# EAGLE design schematic (EAGLE 9.4.2)
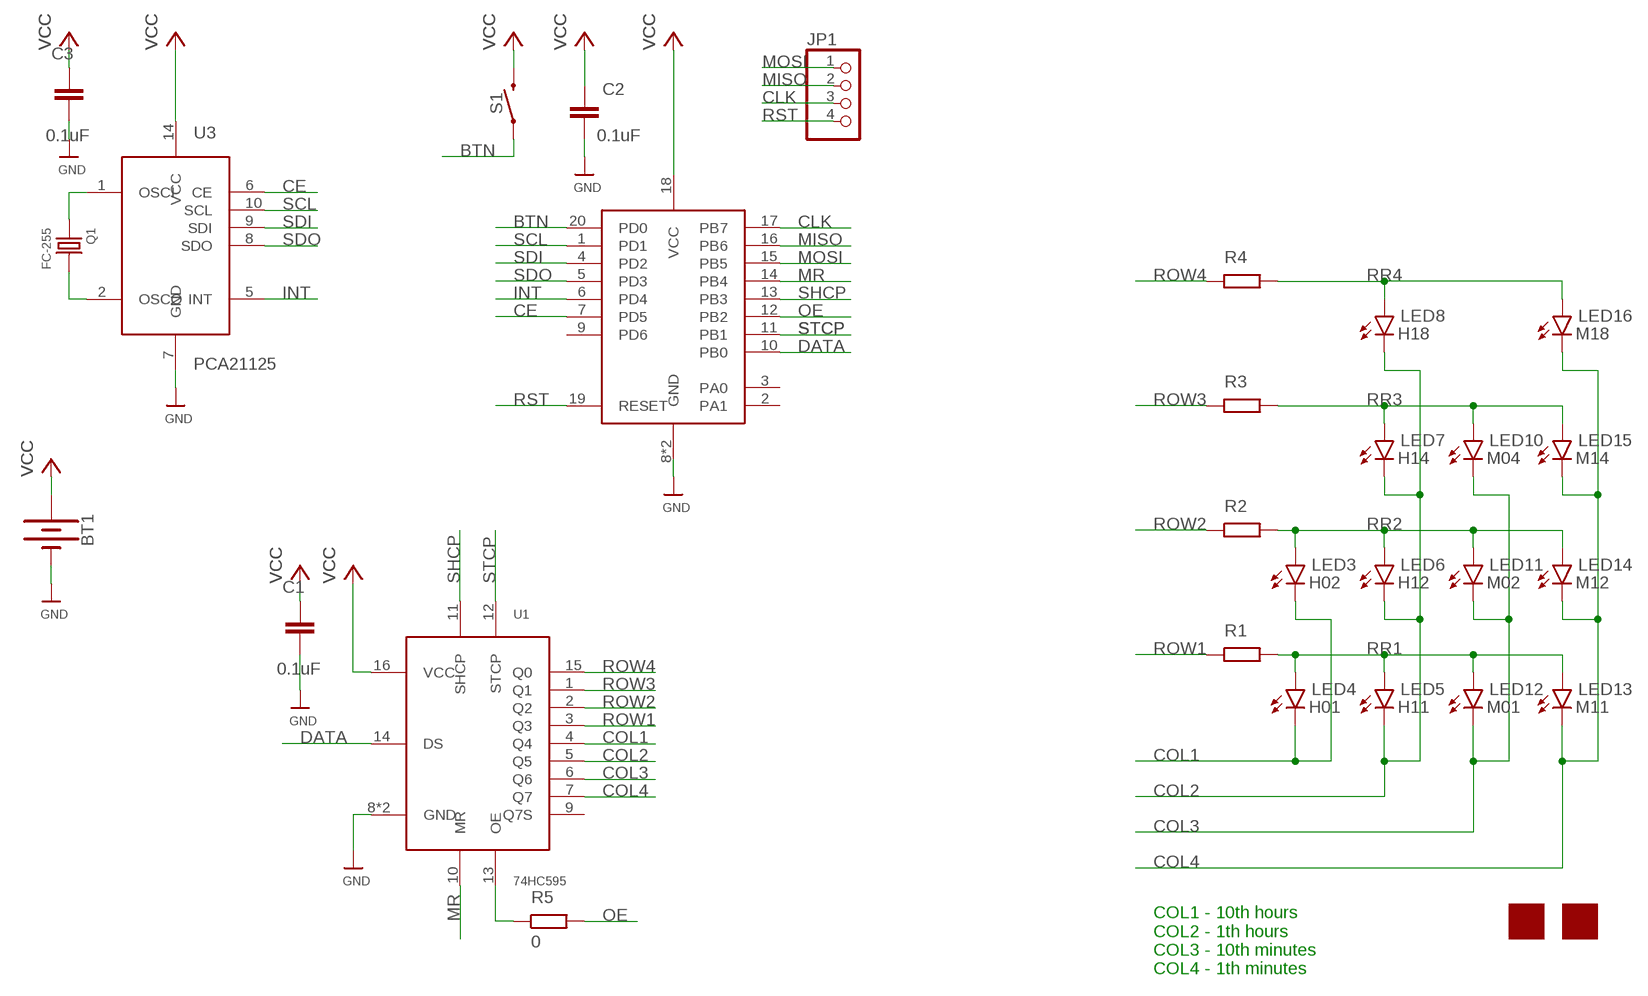
[diagram p0: schematic, sheet 1]

## Parts
BT1  BATTERY-12MM_SMD  [BATTCON_12MM]
C1  0.1uF  CC0402CRNPO9BN1R0  [CAP_0402]
C2  0.1uF  CC0402CRNPO9BN1R0  [CAP_0402]
C3  0.1uF  CC0402CRNPO9BN1R0  [CAP_0402]
IMG1  IMAGE  [IMG6]
IMG2  SLOT  [SLOT]
JP1  PINHD-1X4  [1X04]
LED3  H02  LG-T67K  [LG-T67K]
LED4  H01  LG-T67K  [LG-T67K]
LED5  H11  LG-T67K  [LG-T67K]
LED6  H12  LG-T67K  [LG-T67K]
LED7  H14  LG-T67K  [LG-T67K]
LED8  H18  LG-T67K  [LG-T67K]
LED10  M04  LG-T67K  [LG-T67K]
LED11  M02  LG-T67K  [LG-T67K]
LED12  M01  LG-T67K  [LG-T67K]
LED13  M11  LG-T67K  [LG-T67K]
LED14  M12  LG-T67K  [LG-T67K]
LED15  M14  LG-T67K  [LG-T67K]
LED16  M18  LG-T67K  [LG-T67K]
Q1  FC-255  [FC-255]
R1  R_CHIP-0402(1005-METRIC)  [RESC1005X40]
R2  R_CHIP-0402(1005-METRIC)  [RESC1005X40]
R3  R_CHIP-0402(1005-METRIC)  [RESC1005X40]
R4  R_CHIP-0402(1005-METRIC)  [RESC1005X40]
R5  0  R_CHIP-0402(1005-METRIC)  [RESC1005X40]
S1  MOMENTARY-SWITCH-SPST-SMD-6.2MM-TALL  [TACTILE_SWITCH_SMD_6.2MM_TALL]
U1  74HC595  [DHVQFN16]
U2  ATTINY2313  ATTINY2313AQFN20-3X3  [QFN20-.45MMPITCH]
U3  PCA21125  [TSSOP14]

## Nets
BTN: S1.A2 U2.20(PD0)
CE: U2.7(PD5) U3.6(CE)
CLK: JP1.3 U2.17(PB7)
COL1: LED3.P$2(C) LED4.P$2(C) U1.4(Q4)
COL2: LED5.P$2(C) LED6.P$2(C) LED7.P$2(C) LED8.P$2(C) U1.5(Q5)
COL3: LED10.P$2(C) LED11.P$2(C) LED12.P$2(C) U1.6(Q6)
COL4: LED13.P$2(C) LED14.P$2(C) LED15.P$2(C) LED16.P$2(C) U1.7(Q7)
DATA: U1.14(DS) U2.10(PB0)
GND: BT1.GND(-) C1.2 C2.2 C3.2 U1.8(GND) U1.PAD(GND) U2.8(GND) U2.21(GND) U3.7(GND)
INT: U2.6(PD4) U3.5(INT)
MISO: JP1.2 U2.16(PB6)
MOSI: JP1.1 U2.15(PB5)
MR: U1.10(MR) U2.14(PB4)
N$1: Q1.OUT U3.2(OSCO)
N$2: Q1.IN U3.1(OSCI)
N$3: R5.1 U1.13(OE)
OE: R5.2 U2.12(PB2)
ROW1: R1.1 U1.3(Q3)
ROW2: R2.1 U1.2(Q2)
ROW3: R3.1 U1.1(Q1)
ROW4: R4.1 U1.15(Q0)
RR1: LED4.P$1(A) LED5.P$1(A) LED12.P$1(A) LED13.P$1(A) R1.2
RR2: LED3.P$1(A) LED6.P$1(A) LED11.P$1(A) LED14.P$1(A) R2.2
RR3: LED7.P$1(A) LED10.P$1(A) LED15.P$1(A) R3.2
RR4: LED8.P$1(A) LED16.P$1(A) R4.2
RST: JP1.4 U2.19(RESET)
SCL: U2.1(PD1) U3.10(SCL)
SDI: U2.4(PD2) U3.9(SDI)
SDO: U2.5(PD3) U3.8(SDO)
SHCP: U1.11(SHCP) U2.13(PB3)
STCP: U1.12(STCP) U2.11(PB1)
VCC: BT1.PWR@1(+) C1.1 C2.1 C3.1 S1.B2 U1.16(VCC) U2.18(VCC) U3.14(VCC)
Unconnected: U1.9(Q7S) U2.2(PA1) U2.3(PA0) U2.9(PD6)

## Notes on the sheet
- COL1 - 10th hours
  COL2 - 1th hours
  COL3 - 10th minutes
  COL4 - 1th minutes

## Library data of the parts
BT1 = SparkFun-Batteries:BATTERY: Battery - Single Cell A variety of battery chemistries, sizes, and footprints. Device List: 20MM_PTH - Coin Cell Battery Holder - 20mm (PTH) <https://www.sparkfun.com/products/783> 6.8MM_PTH - Coin Cell Battery Holder - 6.8MM(SMD) <https://www.digikey.com/product-detail/en/seiko-instruments/MS621FE-FL11E/728-1057-ND/1889208?WT.srch=1&gclid=CNOQ5a6LzdQCFZS2wAodXCkE0g> 12MM_SMD - Coin Cell Battery Holder - 12mm (SMD) <https://www.sparkfun.com/products/10592> 12MM_PTH - Coin Cell Battery Holder - 12mm (PTH) <https://www.sparkfun.com/products/7948> 20MM_SMD - 20mm Coin Cell Battery Holder (SMD) (2 legs) Used on the Big Time Watch Kit <https://www.sparkfun.com/products/11734> 20MM_SMD_4LEGS - Coin Cell Battery Holder - 20mm (SMD) <https://www.sparkfun.com/products/11892> 20MM_SMD_4LEGS_OVERPASTE - Coin Cell Battery Holder - 20mm (SMD) <https://www.sparkfun.com/products/11892> (Over-paste on the legs) 24.5MM_PTH - Coin Cell Battery Holder - 24.5mm (PTH) <https://www.sparkfun.com/products/8863> 9V - 9V Battery Holder - PC Mount Used on the SparkFun SparkPunk Sound Kit <https://www.sparkfun.com/products/11177> and SparkFun SparkPunk Sequencer Kit <https://www.sparkfun.com/products/12707> 18650 - Battery Holder - 18650 (PTH) <https://www.sparkfun.com/products/13113> AA - Battery Holder - 1xAA (PTH) <https://www.sparkfun.com/products/7949> AAA - Battery Holder - 1xAAA (PTH) <https://www.sparkfun.com/products/12718> AA_KIT - Battery Holder - 1xAA (PTH) <https://www.sparkfun.com/products/7949> Special kit package - pads only have exposed copper on one side of the board. AAA_KIT - Battery Holder - 1xAAA (PTH) <https://www.sparkfun.com/products/12718> Special kit package - pads only have exposed copper on one side of the board.; PROD_ID: BATT-08044; SF_SKU: PRT-10592
C1-C3 = Resistor_Capacitor:CC0402CRNPO9BN1R0: CAP CER 1PF 50V C0G/NPO 0402 Manufacturer's datasheet <http://www.yageo.com/documents/recent/UPY-GP_NP0_16V-to-50V_16.pdf>; CREATED_BY: PCBLayout.com; DIGIKEY_PART_NUMBER: 311-2076-2-ND; MANUFACTURER: Yageo; MPN: CC0402CRNPO9BN1R0; PACKAGE: SMD 0402
IMG1 = library:IMAGE
IMG2 = library:SLOT
JP1 = pinhead:PINHD-1X4: PIN HEADER
LED3-LED8 LED10-LED16 = library:LG-T67K
Q1 = library:FC-255: FC-255
R1-R5 = Resistor:R: Resistor Fixed - Generic; CATEGORY: Resistor; SUB-CATEGORY: Fixed
S1 = SparkFun-Switches:MOMENTARY-SWITCH-SPST: Momentary Switch (Pushbutton) - SPST Normally-open (NO) SPST momentary switches (buttons, pushbuttons). Variants PTH-12MM - 12mm square, through-hole Momentary Pushbutton Switch - 12mm Square <https://www.sparkfun.com/products/9190> (COM-09190) PTH-6.0MM, PTH-6.0MM-KIT - 6.0mm square, through-hole Mini Pushbutton Switch <https://www.sparkfun.com/products/97> (COM-00097) KIT package intended for soldering kit's - only one side of pads' copper is exposed. PTH-RIGHT-ANGLE-KIT - Right-angle, through-hole Right Angle Tactile Button <https://www.sparkfun.com/products/10791> - Used on SparkFun BigTime Watch Kit <https://www.sparkfun.com/products/11734> SMD-12MM - 12mm square, surface-mount Tactile Button - SMD (12mm) <https://www.sparkfun.com/products/12993> (COM-12993) Used on SparkFun PicoBoard <https://www.sparkfun.com/products/11888> SMD-4.5MM - 4.5mm Square Trackball Switch Used on SparkFun Blackberry Trackballer Breakout <https://www.sparkfun.com/products/13169> SMD-4.6MMX2.8MM - 4.60mm x 2.80mm, surface mount Used on SparkFun SAMD21 Mini Breakout <https://www.sparkfun.com/products/13664> SMD-5.2MM, SMD-5.2-REDUNDANT - 5.2mm square, surface-mount Mini Pushbutton Switch - SMD <https://www.sparkfun.com/products/8720> (COM-08720) Used on Arduino Pro Mini <https://www.sparkfun.com/products/11114> REDUNDANT package connects both switch circuits together SMD-6.0X3.5MM - 6.0 x 3.5mm, surface mount Momentary Reset Switch SMD <https://www.sparkfun.com/products/8229> (COM-08229) SMD-6.2MM-TALL - 6.2mm square, surface mount Tactile Button - SMD (6mm) <https://www.sparkfun.com/products/12992> Used on SparkFun Digital Sandbox <https://www.sparkfun.com/products/12651> SMD-RIGHT-ANGLE - Right-angle, surface mount Used on SparkFun Block for Intel® Edison - Arduino <https://www.sparkfun.com/products/13036>; PROD_ID: SWCH-11966; SF_SKU: COM-12992
U1 = library:74HC595: 8-bit serial-in, serial or parallel-out shift register with output latches; 3-state
U2 = library:ATTINY2313A
U3 = library:PCA21125: SPI-bus Real-Time Clock and calendar

## Board
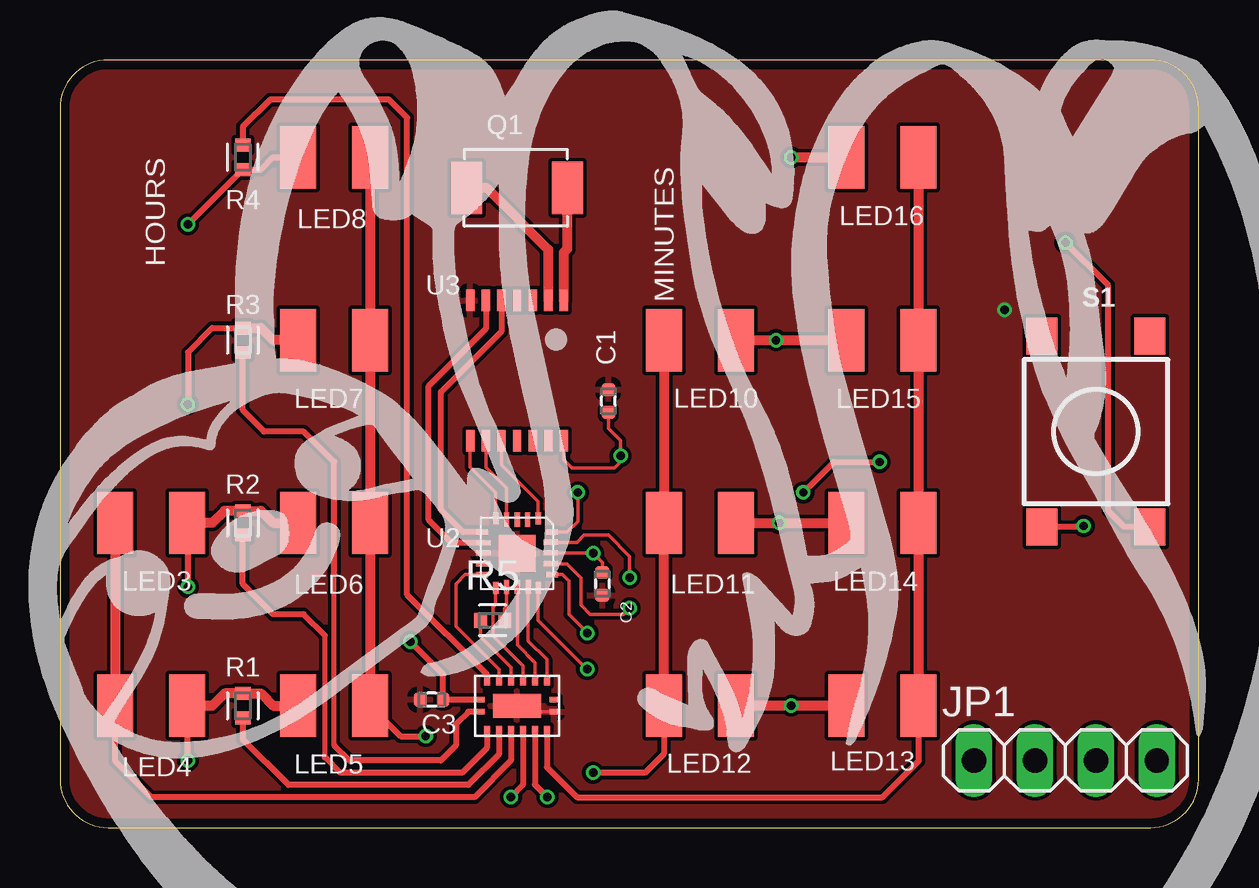
[diagram p1: board, top side]
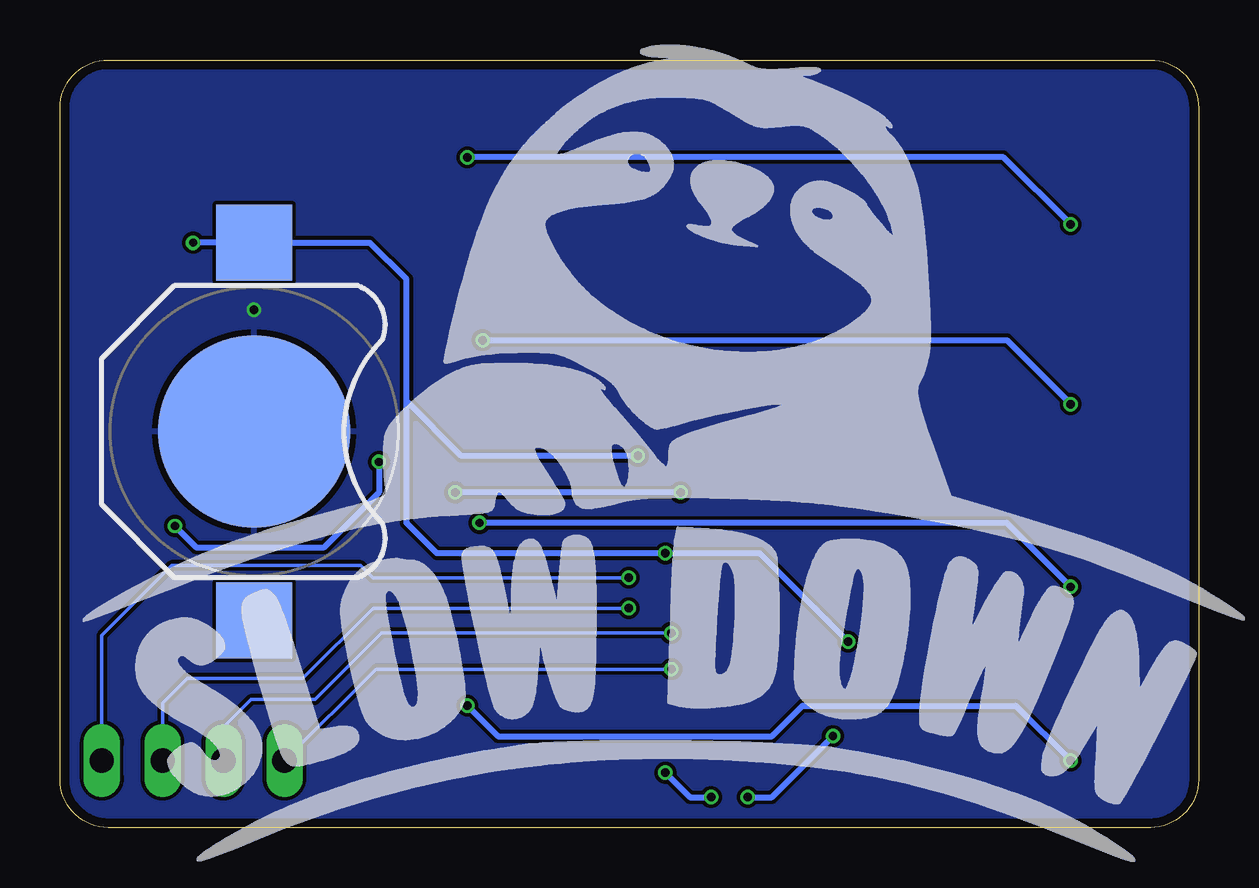
[diagram p2: board, bottom side, seen from below]

Size 47.46 x 32 mm. Coordinates in mm from the lower left corner, seen from the top.
Outline: 0,30 0,2 arc90 2,0 45.46,0 arc90 47.46,2 47.46,30 arc90 45.46,32 2,32 arc90 0,30
Copper layers (1*16): Top 0.035559375mm / dielectric 1.6mm / Bottom 0.035559375mm
Design rules "oshpark-2layer": minimum track width 6mil, minimum drill 10mil, track to track 6mil, track to pad 6mil, pad to pad 6mil, via to via 6mil, smd to smd 6mil, copper to edge 15mil, drill to drill 6mil, minimum pad ring 5mil, minimum via ring 5mil, stop-mask expansion 2.5mil, vias tented up to drill 0mil, thermal gap 10mil

### Footprints (pad centres in the part's own frame; a part is rotated, then mirrored left to right if it is on the bottom)
BATTCON_12MM = smd 8 x 8: GND 0,0 | smd 3.175 x 3.175: PWR@1 -7.874,0; PWR@2 7.874,0
CAP_0402 = smd 0.55 x 0.58: 1 -0.475,0; 2 0.475,0
1X04 = drill 1.016 long: 1 -3.81,0; 2 -1.27,0; 3 1.27,0; 4 3.81,0
LG-T67K = smd 2.6 x 1.5: P$1 0,1.5; P$2 0,-1.5
FC-255 = smd 1.3 x 2.2: IN -2.1,0; OUT 2.1,0
RESC1005X40 = smd 0.535 x 0.644: 1 -0.507,0; 2 0.507,0
TACTILE_SWITCH_SMD_6.2MM_TALL = smd 1.55 x 1.3: A1 -3.975,-2.25; A2 3.975,-2.25; B1 -3.975,2.25; B2 3.975,2.25
DHVQFN16 = smd 0.4 x 0.24: 1 -1.55,-0.25; 8 1.55,-0.25; 9 1.55,0.25; 16 -1.55,0.25 | smd 0.24 x 0.4: 2 -1.25,-1.05; 3 -0.75,-1.05; 4 -0.25,-1.05; 5 0.25,-1.05; 6 0.75,-1.05; 7 1.25,-1.05; 10 1.25,1.05; 11 0.75,1.05; 12 0.25,1.05; 13 -0.25,1.05; 14 -0.75,1.05; 15 -1.25,1.05 | smd 2 x 1: PAD 0,0
QFN20-.45MMPITCH = smd 0.5 x 0.22: 1 -1.45,0.885; 5 -1.45,-0.885; 11 1.45,-0.885; 15 1.45,0.885 | smd 0.6 x 0.22: 2 -1.4,0.435; 3 -1.4,0.015; 4 -1.4,-0.435; 12 1.4,-0.435; 13 1.4,0.015; 14 1.4,0.465 | smd 0.22 x 0.5: 6 -0.885,-1.45; 10 0.885,-1.45; 16 0.885,1.45; 20 -0.885,1.45 | smd 0.22 x 0.6: 7 -0.435,-1.4; 8 -0.015,-1.4; 9 0.435,-1.4; 17 0.435,1.4; 18 -0.015,1.4; 19 -0.465,1.4 | smd 1.55 x 1.55: 21 0,0
TSSOP14 = smd 0.35 x 0.9: 1 -1.95,-2.925; 2 -1.3,-2.925; 3 -0.65,-2.925; 4 0,-2.925; 5 0.65,-2.925; 6 1.3,-2.925; 7 1.95,-2.925; 8 1.95,2.925; 9 1.3,2.925; 10 0.65,2.925; 11 0,2.925; 12 -0.65,2.925; 13 -1.3,2.925; 14 -1.95,2.925

### Placement (x,y rotation side)
BT1  39.37,16.51 270 bottom
C1  22.86,17.78 90 top
C2  22.61,10.16 270 top
C3  15.49,5.33 180 top
IMG1  -1.91,-1.4 0 top
IMG2  -1.27,-11.43 0 top  (outside the outline)
JP1  41.91,2.79 0 top
LED3  3.81,12.7 270 top
LED4  3.81,5.08 270 top
LED5  11.43,5.08 90 top
LED6  11.43,12.7 90 top
LED7  11.43,20.32 90 top
LED8  11.43,27.94 90 top
LED10  26.67,20.32 270 top
LED11  26.67,12.7 270 top
LED12  26.67,5.08 270 top
LED13  34.29,5.08 90 top
LED14  34.29,12.7 90 top
LED15  34.29,20.32 90 top
LED16  34.29,27.94 90 top
Q1  19.05,26.67 180 top
R1  7.62,5.08 90 top
R2  7.62,12.7 90 top
R3  7.62,20.32 90 top
R4  7.62,27.94 270 top
R5  18.03,8.64 0 top
S1  43.18,16.51 270 top
U1  19.05,5.08 0 top
U2  19.05,11.43 270 top
U3  19.05,19.05 180 top

### Tracks (layer width: path | path; a pad name or v marks a point on that pad's centre or on a via)
BTN  (via drill 0.35)
  Top 0.152: U2.20 21.14,12.31 21.59,12.77 v21.59,13.97
  Top 0.254: v42.67,12.57 42.63,12.54 S1.A2 | v30.99,13.97 32.26,15.24 v34.16,15.24
  Bottom 0.254: v21.59,13.97 v30.99,13.97 | v34.16,15.24 34.16,13.97 36.45,11.68 41.78,11.68 v42.67,12.57
CE
  Top 0.254: U3.6 17.75,20.8 15.37,18.41 15.37,12.83 16.33,11.87 U2.7
CLK  (via drill 0.35)
  Top 0.152: v23.75,9.14 23.5,8.89 22.1,8.89 21.72,9.27 21.72,10.41 21.14,10.99 U2.17
  Bottom 0.152: v23.75,9.14 34.42,9.14 37.34,6.22 42.16,6.22 43.18,5.21 JP1.3
COL1
  Top 0.254: U1.4 18.8,2.8 17.27,1.27 3.81,1.27 2.31,2.77 LED4.P$2
  Top 0.406: LED3.P$2 LED4.P$2
COL2  (via drill 0.35)
  Top 0.254: LED5.P$2 14.2,3.81 v15.24,3.81 | U1.5 19.3,1.77 v18.8,1.27
  Top 0.406: LED8.P$2 LED7.P$2 LED6.P$2 LED5.P$2
  Bottom 0.254: v18.8,1.27 17.78,1.27 v15.24,3.81
COL3  (via drill 0.35)
  Top 0.254: v20.32,1.27 19.8,1.79 U1.6 | LED12.P$2 25.17,3.07 24.38,2.29 v22.23,2.29
  Top 0.406: LED10.P$2 LED11.P$2 LED12.P$2
  Bottom 0.254: v22.23,2.29 21.21,1.27 v20.32,1.27
COL4
  Top 0.254: LED13.P$2 35.79,2.77 34.29,1.27 21.55,1.27 20.3,2.52 U1.7
  Top 0.406: LED16.P$2 LED15.P$2 LED14.P$2 LED13.P$2
DATA
  Top 0.152: U2.10 16.89,10.54 16.51,10.16 16.51,8.38 18.3,6.59 U1.14
GND  (via drill 0.35)
  Top 0.152: U1.8 19.3,4.83 U1.PAD
  other vias: 39.37,21.59
  pour Top: 0,2 0,30 arc-90 2,32 45.5,32 arc-90 47.5,30 47.5,2 arc-90 45.5,0 2,0 arc-90
  pour Bottom: 0,2 0,30 arc-90 2,32 45.5,32 arc-90 47.5,30 47.5,2 arc-90 45.5,0 2,0 arc-90
INT
  Top 0.254: U3.5 18.4,20.69 15.88,18.16 15.88,13.25 16.81,12.31 U2.6
MISO  (via drill 0.35)
  Top 0.152: U2.16 20.95,10.54 21.21,10.29 21.21,8.89 v21.99,8.11
  Bottom 0.152: v21.99,8.11 34.05,8.11 36.83,5.33 39.5,5.33 40.64,4.19 JP1.2
MOSI  (via drill 0.35)
  Top 0.152: U2.15 19.93,8.64 v21.97,6.6
  Bottom 0.152: JP1.1 34.29,6.6 v21.97,6.6
MR
  Top 0.152: U2.14 19.52,7.79 20.3,7 U1.10
N$1
  Top 0.406: Q1.OUT 17.78,26.67 20.35,24.1 U3.2
N$2
  Top 0.406: U3.1 21,23.98 21.15,24.13 Q1.IN
N$3
  Top 0.152: U1.13 18.8,6.68 17.53,7.95 R5.1
OE
  Top 0.152: U2.12 18.61,9.22 18.54,9.14 R5.2
ROW1
  Top 0.254: R1.1 7.62,3.68 9.53,1.78 17.02,1.78 18.3,3.06 U1.3
ROW2
  Top 0.203: 11.05,2.92 11.05,8
  Top 0.254: U1.2 17.8,3.32 16.76,2.29 11.68,2.29 11.05,2.92 | 11.05,8 10.16,8.89 8.89,8.89 7.62,10.16 R2.1
ROW3
  Top 0.203: 11.43,3.43 11.43,10.54
  Top 0.254: U1.1 17.02,4.83 16.51,4.32 16.51,3.43 15.88,2.79 12.06,2.79 11.43,3.43 | 11.43,10.54 11.43,15.24 10.16,16.51 8.51,16.51 7.62,17.4 R3.1
ROW4
  Top 0.254: U1.15 17.8,6.38 14.48,9.71 14.48,29.59 13.72,30.35 8.76,30.35 7.62,29.21 R4.1
RR1  (via drill 0.35)
  Top 0.254: v5.33,2.79 5.31,2.82 LED4.P$1
  Top 0.406: LED13.P$1 v30.48,5.08 LED12.P$1 | LED4.P$1 6.35,5.08 6.86,5.59 R1.2 8.38,5.59 8.89,5.08 LED5.P$1
  Bottom 0.254: v5.33,2.79 7.62,5.08 16.51,5.08 17.78,3.81 29.21,3.81 v30.48,5.08
RR2  (via drill 0.35)
  Top 0.254: v5.33,10.03 5.33,12.68 LED3.P$1
  Top 0.406: LED11.P$1 v29.97,12.7 LED14.P$1 | LED3.P$1 6.35,12.7 6.86,13.21 R2.2 8.38,13.21 8.89,12.7 LED6.P$1
  Bottom 0.254: v5.33,10.03 8,12.7 v29.97,12.7
RR3  (via drill 0.35)
  Top 0.254: v5.33,17.65 5.33,19.81 6.35,20.83 R3.2
  Top 0.406: LED10.P$1 v29.84,20.32 LED15.P$1 | LED7.P$1 8.89,20.32 8.38,20.83 R3.2
  Bottom 0.254: v29.84,20.32 8,20.32 v5.33,17.65
RR4  (via drill 0.35)
  Top 0.152: v5.33,25.15
  Top 0.254: LED8.P$1 8.89,27.94 8.38,27.43 R4.2 v5.33,25.15
  Top 0.406: v30.48,27.94 LED16.P$1
  Bottom 0.254: v5.33,25.15 8.13,27.94 v30.48,27.94
RST  (via drill 0.35)
  Top 0.152: v23.75,10.41 23.75,11.3 22.86,12.19 21.84,12.19 21.55,11.89 U2.19
  Bottom 0.152: v23.75,10.41 34.42,10.41 34.92,10.92 42.8,10.92 45.72,8 JP1.4
SCL
  Top 0.152: U2.1 19.93,13.59 18.4,15.12 U3.10
SDI
  Top 0.152: U2.4 18.61,14.15 17.75,15.02 U3.9
SDO
  Top 0.152: U2.5 18.16,13.97 17.1,15.03 U3.8
SHCP
  Top 0.152: U2.13 19.07,7.61 19.8,6.87 U1.11
STCP
  Top 0.152: U2.11 18.16,9.3 18.05,9.18 18.05,7.99 19.3,6.73 U1.12
VCC  (via drill 0.35)
  Top 0.152: C2.1 22.61,11.05 v22.23,11.43 22.21,11.45 U2.18 | C1.1 22.86,16.64 23.37,16.13 v23.37,15.49 23.37,15.24 23.11,14.99 21.34,14.99 21,15.32 U3.14
  Top 0.254: U1.16 C3.1 15.97,6.38 v14.61,7.75 | S1.B2 44.36,12.54 43.69,13.21 43.69,22.61 v41.91,24.38
  Bottom 0.254: v14.61,7.75 18.29,11.43 v22.23,11.43 31.75,11.43 33.02,12.7 33.02,17.78 | 33.02,17.78 33.02,22.86 34.54,24.38 BT1.PWR@1 v41.91,24.38 | v23.37,15.49 30.73,15.49 33.02,17.78

### Text on the board
tPlace: HOURS | MINUTES